# EAGLE design mosfet2 (EAGLE 6.4)
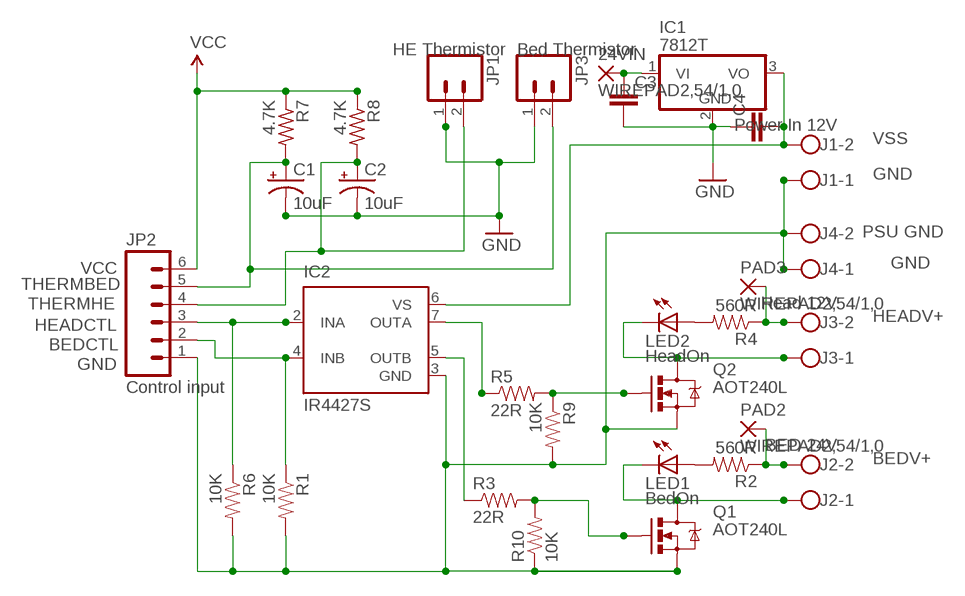
[diagram p0: schematic, sheet 1]

## Parts
24VIN  WIREPAD2,54/1,0  [2,54/1,0]
C1  10uF  CAP_POLPTH2  [CPOL-RADIAL-10UF-25V]
C2  10uF  CAP_POLPTH2  [CPOL-RADIAL-10UF-25V]
C3  CAPEZ  [CAP-PTH-SMALLEZ]
C4  CAPEZ  [CAP-PTH-SMALLEZ]
IC1  7812T  [TO220H]
IC2  IR4427S  [SO08]
J1  Power In 12V  W237-102  [W237-102]
J2  BED 24V  W237-102  [W237-102]
J3  Head 12V  W237-102  [W237-102]
J4  PSU GND  W237-102  [W237-102]
JP1  HE Thermistor  M02PTH  [1X02]
JP2  Control input  M06SIP  [1X06]
JP3  Bed Thermistor  M02PTH  [1X02]
LED1  BedOn  LED-3MM-NO_SILK  [LED3MM-NS]
LED2  HeadOn  LED-3MM-NO_SILK  [LED3MM-NS]
PAD2  WIREPAD2,54/1,0  [2,54/1,0]
PAD3  WIREPAD2,54/1,0  [2,54/1,0]
Q1  AOT240L  MOSFET-NCHANNELPTH2  [TO220V]
Q2  AOT240L  MOSFET-NCHANNELPTH2  [TO220V]
R1  10K  RESISTORPTH-1/4W  [AXIAL-0.4]
R2  560R  RESISTORPTH-1/4W  [AXIAL-0.4]
R3  22R  RESISTORPTH-1/4W  [AXIAL-0.4]
R4  560R  RESISTORPTH-1/4W  [AXIAL-0.4]
R5  22R  RESISTORPTH-1/4W  [AXIAL-0.4]
R6  10K  RESISTORPTH-1/4W  [AXIAL-0.4]
R7  4.7K  R-US_0204/7  [0204/7]
R8  4.7K  R-US_0204/7  [0204/7]
R9  10K  RESISTORPTH-1/4W  [AXIAL-0.4]
R10  10K  RESISTORPTH-1/4W  [AXIAL-0.4]

## Nets
BEDCTL: IC2.4(INB) JP2.2 R1.P$1
BEDV+: J2.2 PAD2.1(P) R2.P$1
GND: C1.2(-) C2.2(-) C3.2 C4.1 IC1.2(GND) IC2.3(GND) J1.1 J4.1 J4.2 JP1.1 JP2.1 JP3.1 Q1.3(S) Q2.3(S) R1.P$2 R6.P$2 R9.P$2 R10.P$1
HEADCTL: IC2.2(INA) JP2.3 R6.P$1
HEADV+: J3.2 PAD3.1(P) R4.P$1
N$1: 24VIN.1(P) C3.1 IC1.1(VI)
N$2: IC2.5(OUTB) R3.P$1
N$3: Q1.1(G) R3.P$2 R10.P$2
N$4: LED1.A R2.P$2
N$5: J2.1 LED1.K(C) Q1.2(D)
N$6: LED2.A R4.P$2
N$7: Q2.1(G) R5.P$2 R9.P$1
N$8: IC2.7(OUTA) R5.P$1
N$9: J3.1 LED2.K(C) Q2.2(D)
THERMBED: C1.1(+) JP2.5 JP3.2 R7.2
THERMHE: C2.1(+) JP1.2 JP2.4 R8.2
VCC: JP2.6 R7.1 R8.1
VSS: C4.2 IC1.3(VO) IC2.6(VS) J1.2

## Library data of the parts
24VIN PAD2 PAD3 = wirepad:WIREPAD: Wire PAD connect wire on PCB
C1 C2 = SparkFun-Capacitors:CAP_POL: Capacitor Polarized These are standard SMD and PTH capacitors. Normally 10uF, 47uF, and 100uF in electrolytic and tantalum varieties. Always verify the external diameter of the through hole cap, it varies with capacity, voltage, and manufacturer. The EIA devices should be standard.
C3 C4 = SparkFun-Passives:CAP: Capacitor Standard 0603 ceramic capacitor, and 0.1" leaded capacitor.
IC1 = adafruit:78*: Positive VOLTAGE REGULATOR Added bigger pads to the TO-92 package
IC2 = ir:IR4427: DUAL LOW SIDE DRIVER Source: ID4426.pdf; MF: INTERNATIONAL RECTIFIER(IR); MPN: IR4427STRPBF; OC_FARNELL: 8639094; OC_NEWARK: 63J7933
J1-J4 = con-wago-500:W237-102: WAGO SCREW CLAMP; MPN: 237-102; OC_FARNELL: unknown; OC_NEWARK: 70K9898
JP1 JP3 = SparkFun-Connectors:M02: Header 2 Standard 2-pin 0.1" header. Use with straight break away headers (SKU : PRT-00116), right angle break away headers (PRT-00553), swiss pins (PRT-00743), machine pins (PRT-00117), and female headers (PRT-00115). Molex polarized connector foot print use with SKU : PRT-08233 with associated crimp pins and housings.
JP2 = SparkFun-Connectors:M06: Header 6 Standard 6-pin 0.1" header. Use with straight break away headers (SKU : PRT-00116), right angle break away headers (PRT-00553), swiss pins (PRT-00743), machine pins (PRT-00117), and female headers (PRT-00115). Molex polarized connector foot print use with SKU : PRT-08094 with associated crimp pins and housings. NOTES ON THE VARIANTS LOCK and LOCK_LONGPADS... This footprint was designed to help hold the alignment of a through-hole component (i.e. 6-pin header) while soldering it into place. You may notice that each hole has been shifted either up or down by 0.005 of an inch from it's more standard position (which is a perfectly straight line). This slight alteration caused the pins (the squares in the middle) to touch the edges of the holes. Because they are alternating, it causes a "brace" to hold the component in place. 0.005 has proven to be the perfect amount of "off-center" position when using our standard breakaway headers. Although looks a little odd when you look at the bare footprint, once you have a header in there, the alteration is very hard to notice. Also, if you push a header all the way into place, it is covered up entirely on the bottom side. This idea of altering the position of holes to aid alignment will be further integrated into the Sparkfun Library for other footprints. It can help hold any component with 3 or more connection pins.
LED1 LED2 = SparkFun-LED:LED: LEDs Standard schematic elements and footprints for 5mm, 3mm, 1206, and 0603 sized LEDs. 5mm - Spark Fun Electronics SKU : COM-00529 (and others)
Q1 Q2 = SparkFun-DiscreteSemi:MOSFET-NCHANNEL: Generic NMOS footprint
R1-R6 R9 R10 = SparkFun-Resistors:RESISTOR: Resistor Basic schematic elements and footprints for 0603, 1206, and PTH resistors.
R7 R8 = resistor:R-US_: RESISTOR, American symbol

## Board
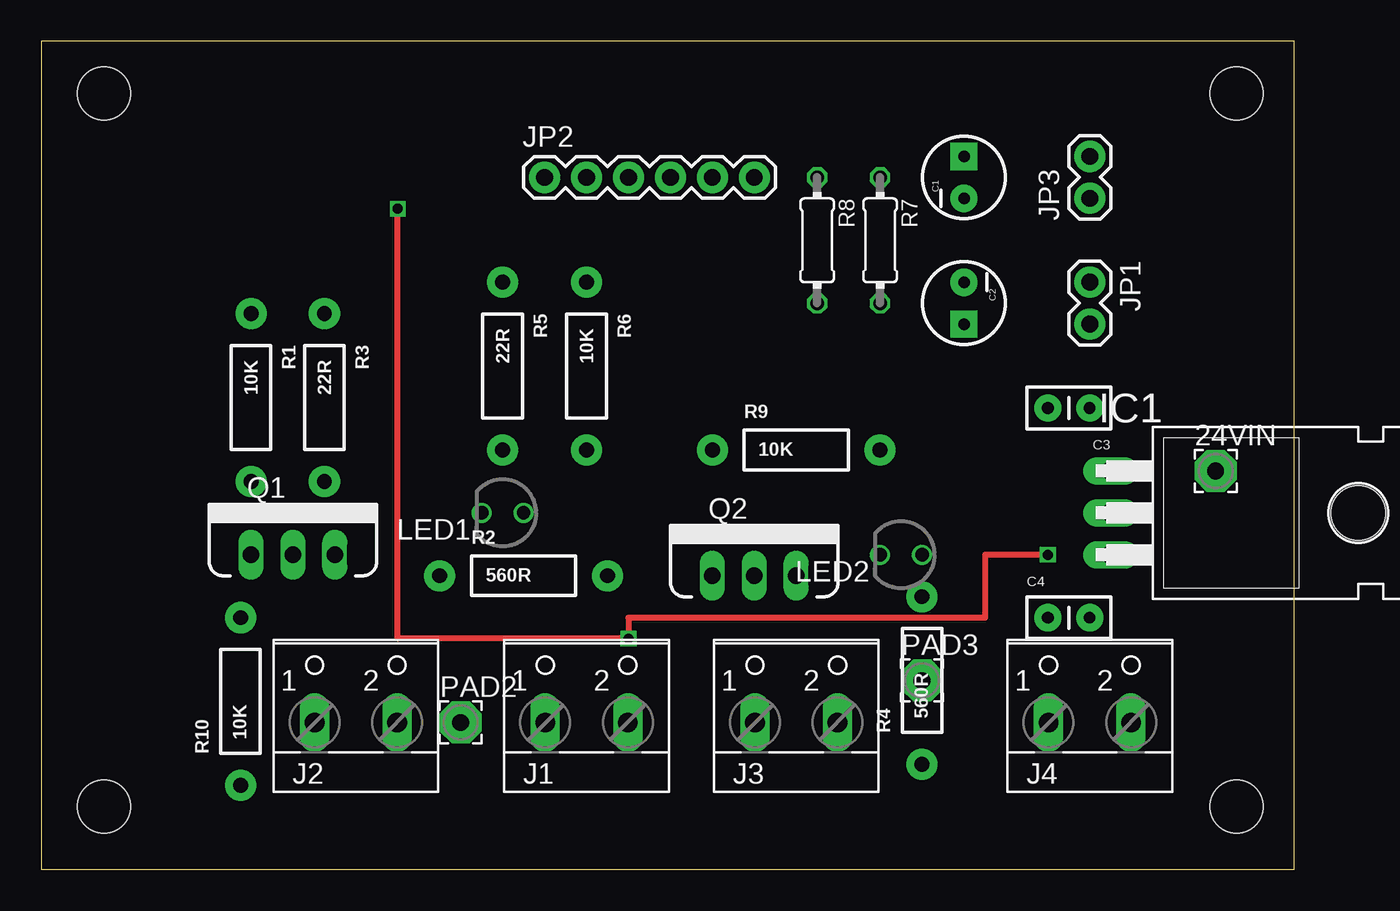
[diagram p1: board, top side]
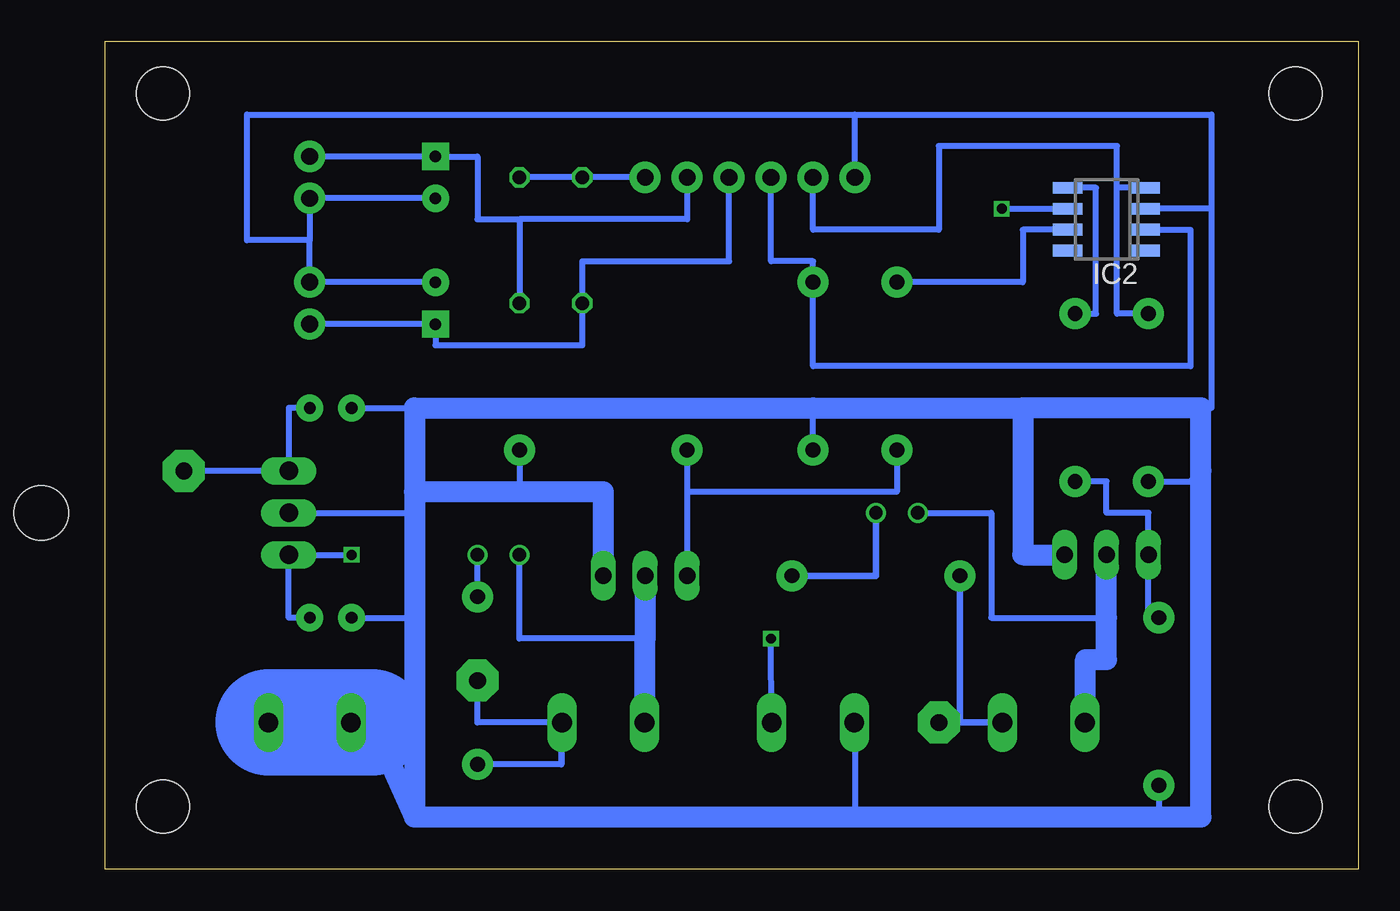
[diagram p2: board, bottom side, seen from below]

Size 75.87 x 50.16 mm. Coordinates in mm from the lower left corner, seen from the top.
Outline: 0,0 75.87,0 75.87,50.16 0,50.16 0,0
Copper layers (1*16): Top 0.0356mm / dielectric 1.5011mm / Bottom 0.0356mm
Design rules "LaenPCBOrder": minimum track width 6mil, minimum drill 13mil, track to track 6mil, track to pad 6mil, pad to pad 6mil, via to via 6mil, smd to smd 6mil, copper to edge 15mil, drill to drill 6mil, minimum pad ring 7mil, minimum via ring 7mil, stop-mask expansion 4mil, vias tented up to drill 0mil, thermal gap 10mil
Holes 3.2 mm at 3.81,46.99 72.39,46.99 72.39,3.81 3.81,3.81

### Footprints (pad centres in the part's own frame; a part is rotated, then mirrored left to right if it is on the bottom)
2,54/1,0 = drill 1.016 pad 2.54 octagon: 1 0,0
CPOL-RADIAL-10UF-25V = drill 0.7 pad 1.651 square: 1 1.27,0 | drill 0.7 pad 1.651: 2 -1.27,0
CAP-PTH-SMALLEZ = drill 0.7 pad 1.651: 1 0,0; 2 2.54,0
TO220H = drill 1.118 long: 1 -2.54,-10.16; 2 0,-10.16; 3 2.54,-10.16 | hole 3.302: 0,4.826
SO08 = smd 0.72 x 1.78: 1 -1.905,-2.35; 2 -0.635,-2.35; 3 0.635,-2.35; 4 1.905,-2.35; 5 1.905,2.35; 6 0.635,2.35; 7 -0.635,2.35; 8 -1.905,2.35
W237-102 = drill 1.194 long: 1 -2.5,-1.27; 2 2.5,-1.27
1X02 = drill 1.016 pad 1.88: 1 0,0; 2 2.54,0
1X06 = drill 1.016 pad 1.88: 1 0,0; 2 2.54,0; 3 5.08,0; 4 7.62,0; 5 10.16,0; 6 12.7,0
LED3MM-NS = drill 0.813: A -1.27,0; K 1.27,0
TO220V = drill 1.016 long: 1 -2.54,0; 2 0,0; 3 2.54,0
AXIAL-0.4 = drill 0.9 pad 1.88: P$1 -5.08,0; P$2 5.08,0
0204/7 = drill 0.813 octagon: 1 -3.81,0; 2 3.81,0

### Placement (x,y rotation side)
24VIN  71.12,24.13 0 top
C1  55.88,41.91 90 top
C2  55.88,34.29 270 top
C3  63.5,27.94 180 top
C4  60.96,15.24 0 top
IC1  74.93,21.59 270 top
IC2  15.24,39.37 90 bottom
J1  33.02,10.16 0 top
J2  19.05,10.16 0 top
J3  45.72,10.16 0 top
J4  63.5,10.16 0 top
JP1  63.5,35.56 270 top
JP2  30.48,41.91 0 top
JP3  63.5,40.64 90 top
LED1  27.94,21.59 180 top
LED2  52.07,19.05 180 top
PAD2  25.4,8.89 0 top
PAD3  53.34,11.43 0 top
Q1  15.24,19.05 0 top
Q2  43.18,17.78 0 top
R1  12.7,28.57 270 top
R2  29.21,17.78 0 top
R3  17.14,28.57 270 top
R4  53.34,11.43 90 top
R5  27.94,30.48 270 top
R6  33.02,30.48 270 top
R7  50.8,38.1 270 top
R8  46.99,38.1 270 top
R9  45.72,25.4 0 top
R10  12.06,10.16 90 top

### Tracks (layer width: path | path; a pad name or v marks a point on that pad's centre or on a via)
BEDCTL
  Bottom 0.35: R1.P$1 14.61,33.66 14.61,41.27 | IC2.4 14.61,41.27 | 14.61,41.27 14.61,43.81 25.4,43.81 25.4,38.73 33.02,38.73 JP2.2
BEDV+
  Bottom 0.35: PAD2.1 22.86,8.89
  Bottom 0.406: J2.2 22.86,8.89 24.13,8.89 R2.P$1
GND
  Bottom 0.35: 8.89,40.01 IC2.3 | 8.89,40.01 8.89,45.72 30.48,45.72 | R1.P$2 10.16,23.5 9.53,24.13 | R6.P$2 33.02,27.94 | 8.89,40.01 8.89,27.94 57.15,27.94 C3.2 | 63.5,38.1 JP3.1 C1.2 | 63.5,38.1 JP1.1 C2.2 | 63.5,38.1 67.31,38.1 67.31,45.72 30.48,45.72 | JP2.1 30.48,45.72 | J1.1 30.48,8.89 30.48,3.17 | R10.P$1 12.06,3.17 | R9.P$2 50.8,22.86 | IC1.2 57.15,21.59 | C4.1 57.15,15.24
  Bottom 1.27: 20.32,27.94 9.53,27.94 9.53,24.13 9.53,3.17 12.06,3.17 30.48,3.17 57.15,3.17 | 20.32,27.94 20.32,19.05 Q1.3 | 20.32,27.94 33.02,27.94 57.15,27.94 57.15,22.86 | 57.15,22.86 57.15,21.59 57.15,15.24 57.15,3.17 | 57.15,3.17 59.73,8.89 | Q2.3 45.72,22.86 50.8,22.86 57.15,22.86
  Bottom 6.452: 59.73,8.89 J4.1 J4.2
HEADCTL
  Bottom 0.35: IC2.2 10.16,38.73 10.16,30.48 33.02,30.48 R6.P$1 33.02,36.83 35.56,36.83 JP2.3
HEADV+
  Bottom 0.35: J3.2 48.26,6.35 | 48.26,6.35 R4.P$1 | 48.26,6.35 48.26,8.89 53.34,8.89 PAD3.1
N$1
  Bottom 0.35: 24VIN.1 IC1.1 64.77,27.94 C3.1
N$2
  Bottom 0.35: R3.P$1 15.88,33.66 15.88,41.27 IC2.5
N$3
  Bottom 0.35: R3.P$2 15.24,23.5 15.24,21.59 12.7,21.59 Q1.1 12.7,15.24 R10.P$2
N$4
  Bottom 0.406: LED1.A 29.21,17.78 R2.P$2
N$5
  Bottom 0.35: J2.1 16.51,12.7 | LED1.K 22.23,21.59 22.23,15.24 15.24,15.24
  Bottom 1.27: 16.51,8.89 16.51,12.7 15.24,12.7 15.24,15.24 Q1.2
N$6
  Bottom 0.35: R4.P$2 LED2.A
N$7
  Bottom 0.35: 40.64,22.86 Q2.1 | R5.P$2 27.94,22.86 40.64,22.86 | R9.P$1 40.64,22.86
N$8
  Bottom 0.35: IC2.7 20.32,38.73 20.32,35.56 R5.P$1
N$9
  Bottom 0.35: J3.1 43.18,8.89 | 43.18,13.97 50.8,13.97 LED2.K
  Bottom 1.27: 43.18,8.89 43.18,13.97 Q2.2
THERMBED
  Bottom 0.35: JP2.5 40.64,39.37 50.8,39.37 | JP3.2 C1.1 53.34,43.18 53.34,39.37 50.8,39.37 | 50.8,39.37 R7.2
THERMHE
  Bottom 0.35: JP2.4 38.1,36.83 46.99,36.83 R8.2 46.99,31.75 55.88,31.75 C2.1 JP1.2
VCC
  Bottom 0.35: R7.1 R8.1 JP2.6
VSS  (via drill 0.6)
  Top 0.35: v21.59,40.01 21.59,13.97 v35.56,13.97 35.56,15.24 57.15,15.24 57.15,19.05 v60.96,19.05
  Bottom 0.35: J1.2 v35.56,13.97 | v21.59,40.01 IC2.6 | v60.96,19.05 IC1.3 64.77,15.24 C4.2